# Altium schematic sheet Recortes.SchDoc
size 431 x 279 mm; SheetNumber: 10; SheetTotal: 10
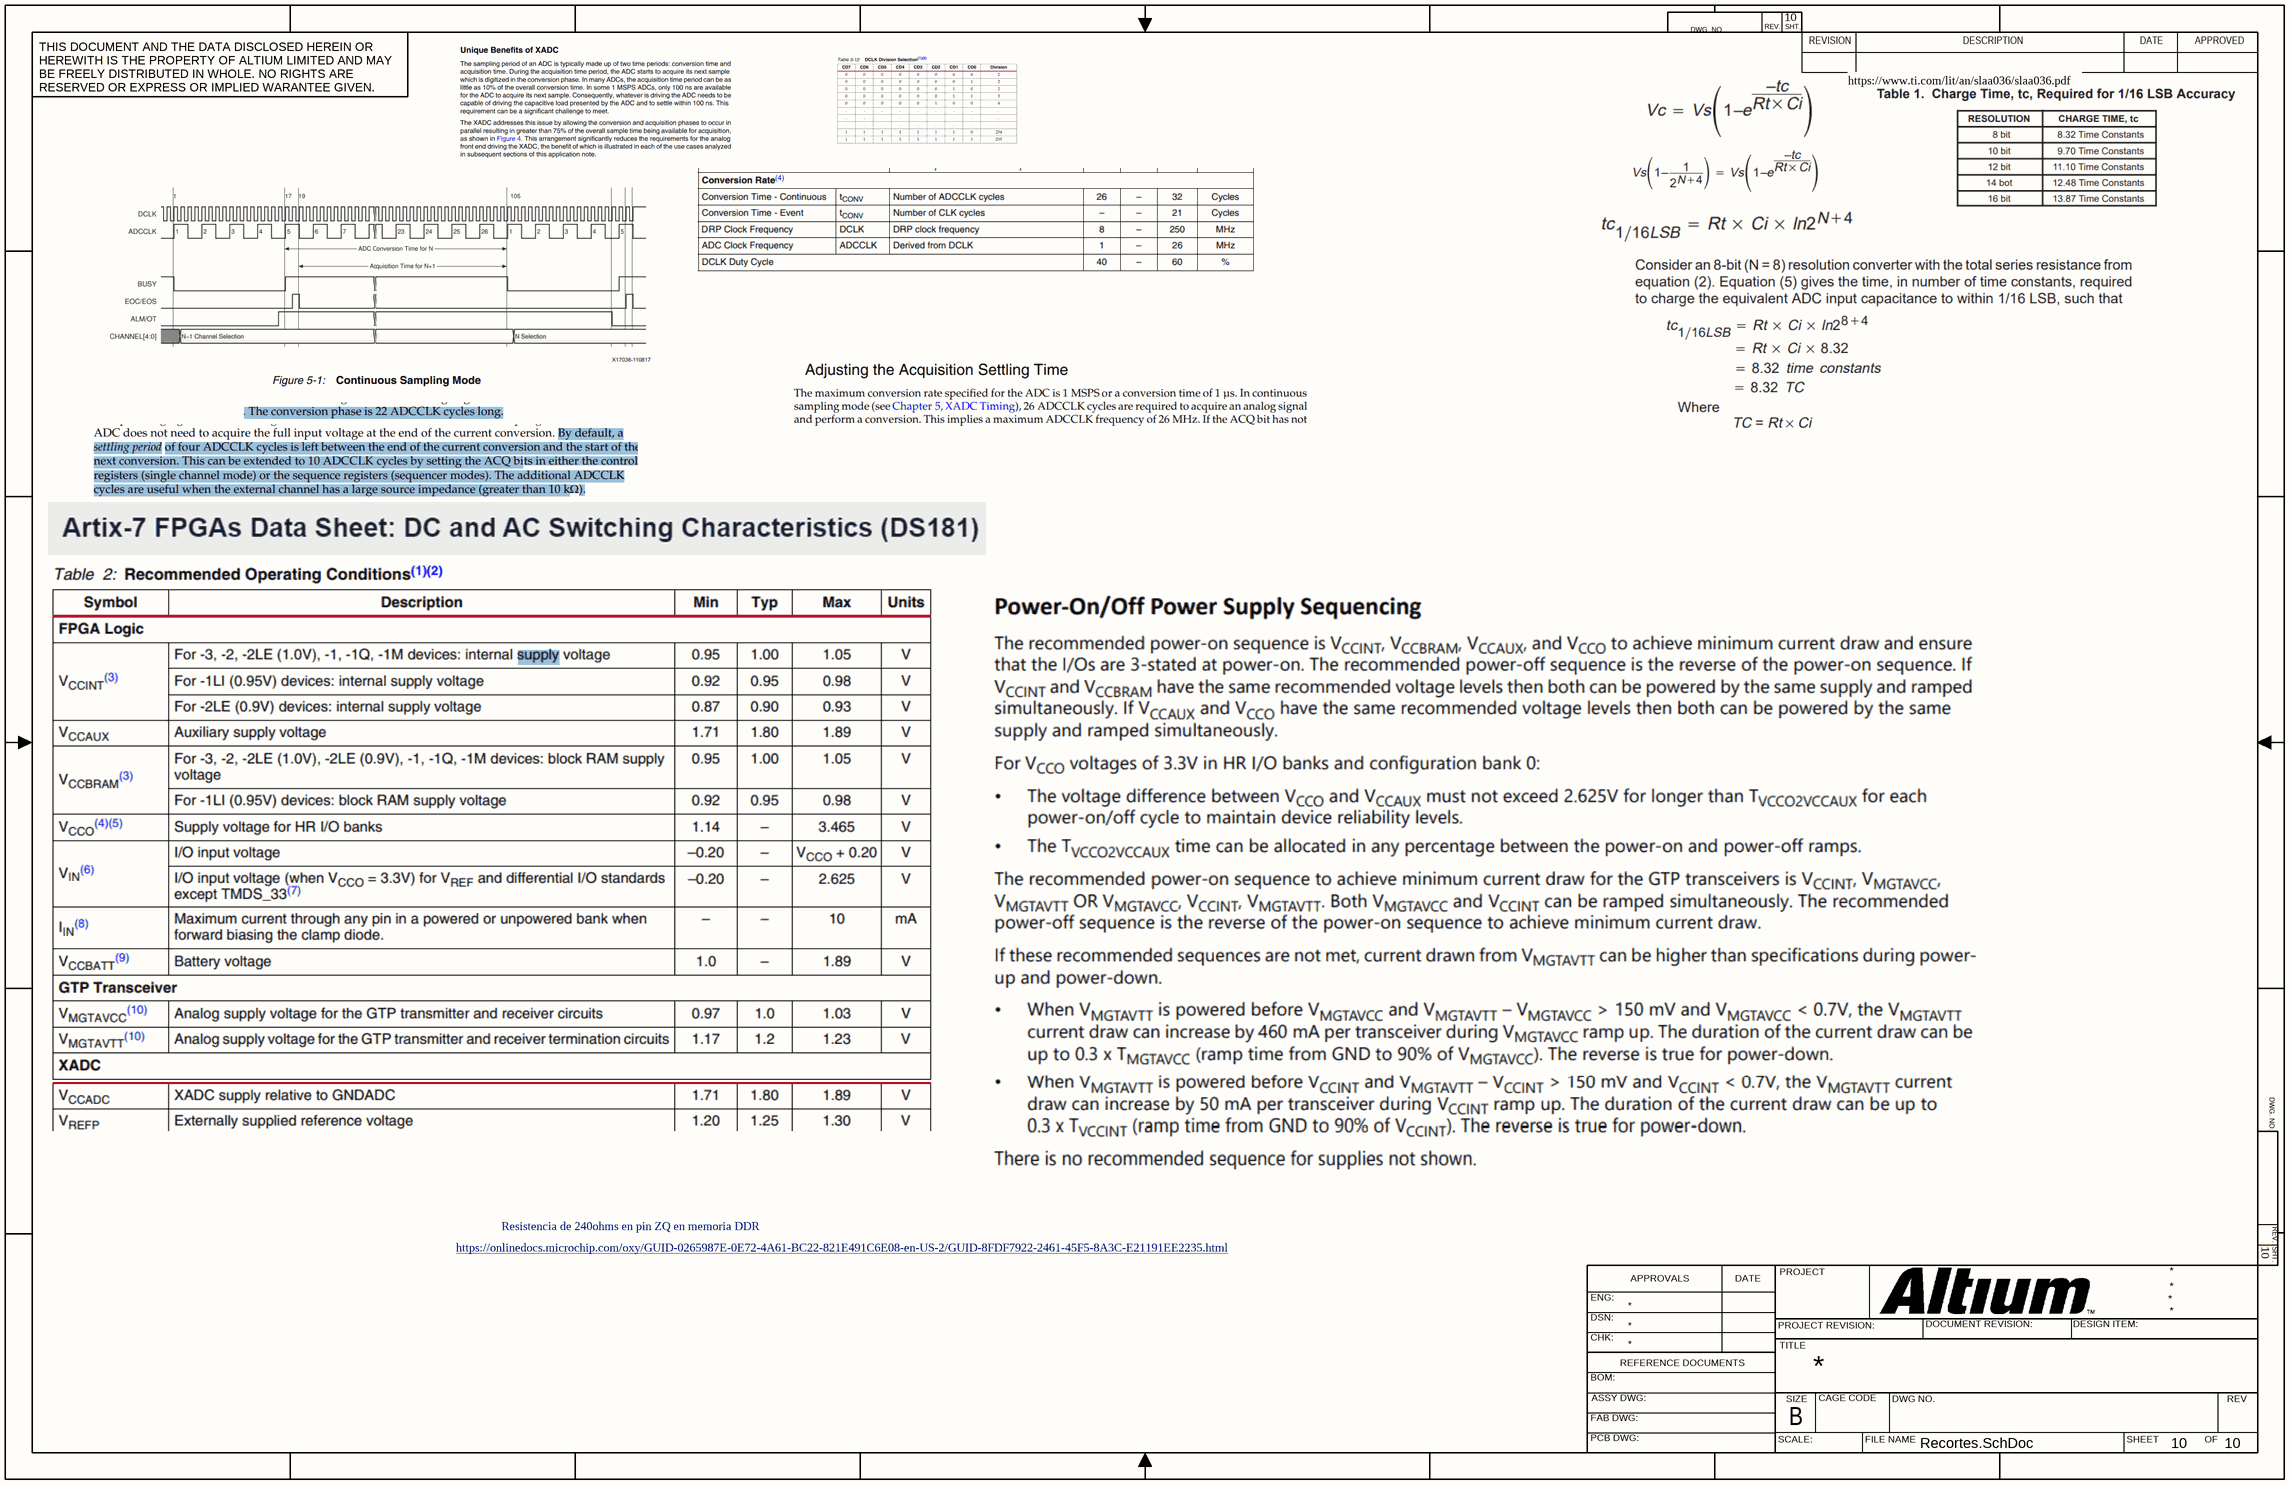
[diagram p0: Recortes.SchDoc]

## Notes on the sheet
- https://www.ti.com/lit/an/slaa036/slaa036.pdf
- Resistencia de 240ohms en pin ZQ en memoria DDR
- https://onlinedocs.microchip.com/oxy/GUID-0265987E-0E72-4A61-BC22-821E491C6E08-en-US-2/GUID-8FDF7922-2461-45F5-8A3C-E21191EE2235.html
- DWG. NO.
- REV.
- SHT.
- THIS DOCUMENT AND THE DATA DISCLOSED HEREIN OR HEREWITH IS THE PROPERTY OF ALTIUM LIMITED AND MAY BE FREELY DISTRIBUTED IN WHOLE. NO RIGHTS ARE RESERVED OR EXPRESS OR IMPLIED WARANTEE GIVEN.
- REVISION
- DESCRIPTION
- DATE
- APPROVED
- ENG:
- APPROVALS
- PROJECT
- DSN:
- CHK:
- REFERENCE DOCUMENTS
- PROJECT REVISION:
- TITLE
- DOCUMENT REVISION:
- DESIGN ITEM:
- BOM:
- FAB DWG:
- PCB DWG:
- ASSY DWG:
- SCALE:
- SIZE
- B
- CAGE CODE
- FILE NAME
- DWG NO.
- SHEET
- OF
- REV